# Altium schematic sheet connector.SchDoc
size A4
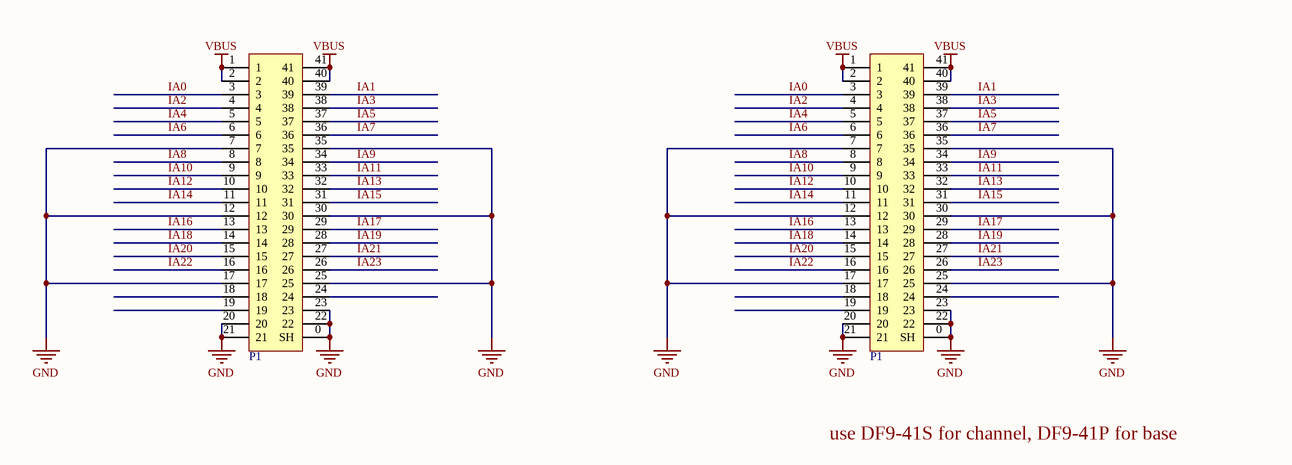
[diagram p0: connector.SchDoc]

## Parts
(Parts that share a designator on the sheet are numbered #1, #2 ... from top to bottom, then left to right.)
P1#1  DF9-41S  [DF9-41S]  (value not drawn)
P1#2  DF9-41S  [DF9-41S]  (value not drawn)

## Nets
GND: P1#1.0(SH) P1#1.7 P1#1.12 P1#1.17 P1#1.20 P1#1.21 P1#1.22 P1#1.23 P1#1.25 P1#1.30 P1#1.35 P1#2.0(SH) P1#2.7 P1#2.12 P1#2.17 P1#2.20 P1#2.21 P1#2.22 P1#2.23 P1#2.25 P1#2.30 P1#2.35
VBUS: P1#1.1 P1#1.2 P1#1.40 P1#1.41 P1#2.1 P1#2.2 P1#2.40 P1#2.41
IA0: P1#1.3 P1#2.3
IA1: P1#1.39 P1#2.39
IA2: P1#1.4 P1#2.4
IA3: P1#1.38 P1#2.38
IA4: P1#1.5 P1#2.5
IA5: P1#1.37 P1#2.37
IA6: P1#1.6 P1#2.6
IA7: P1#1.36 P1#2.36
IA8: P1#1.8 P1#2.8
IA9: P1#1.34 P1#2.34
IA10: P1#1.9 P1#2.9
IA11: P1#1.33 P1#2.33
IA12: P1#1.10 P1#2.10
IA13: P1#1.32 P1#2.32
IA14: P1#1.11 P1#2.11
IA15: P1#1.31 P1#2.31
IA16: P1#1.13 P1#2.13
IA17: P1#1.29 P1#2.29
IA18: P1#1.14 P1#2.14
IA19: P1#1.28 P1#2.28
IA20: P1#1.15 P1#2.15
IA21: P1#1.27 P1#2.27
IA22: P1#1.16 P1#2.16
IA23: P1#1.26 P1#2.26

Not connected (* = marked no-connect by the designer): P1#1 18 19 24; P1#2 18 19 24

## Notes on the sheet
- use DF9-41S for channel, DF9-41P for base